# Altium project PROC154E3_SCH.PrjPcb (part 60 of 60)
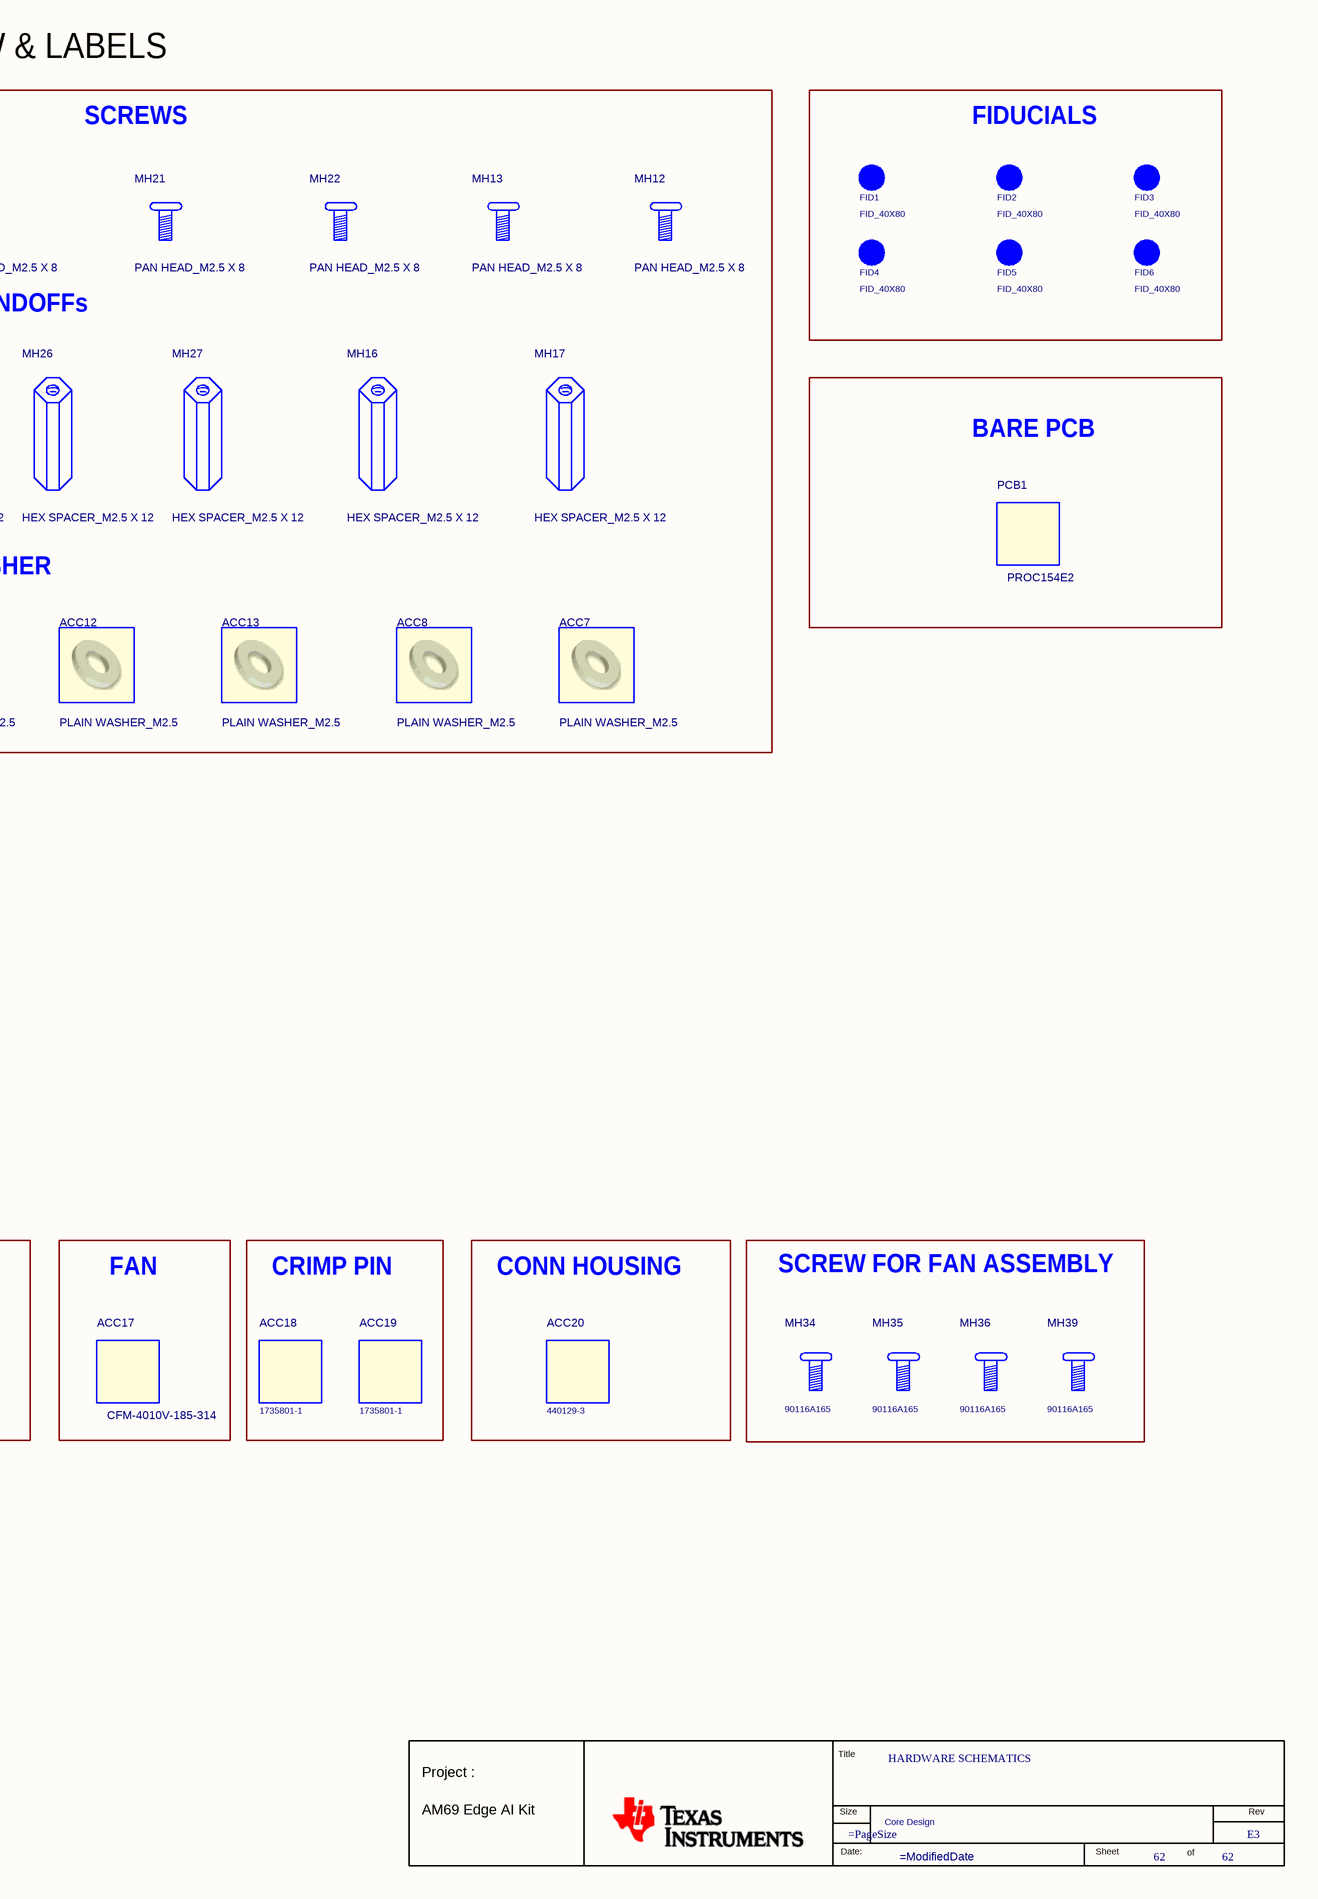
[diagram p108: 62. SK NOTES, HW & LABELS.SchDoc, right]

## Nets that join several sheets
V_3V3: 16. SOC MCU OSPI0 FLASH (C753.1 R519.1 R521.2 U47.1), 17. SOC MCU & MAIN GEN IO, OSC (12 pins), 18. SOC GENERAL (6 pins), 19. SOC MCU RGMII & MMC & ADCs (R344.1 R486.1 U42.6), 20. SOC DEBUG (7 pins), 26. RESET BUTTONs (R272.2), 27. CPLD (13 pins), 28. BOARD ID & 40 Pin EXP Hdr (11 pins), 29. eMMC (C52.2 C350.1 FL78.1 U72.5), 30. MICRO SDCARD INTERFACE (7 pins), 31. USB HUB (5 pins), 32. USB 3.0 TYPE A CONN#1 (R103.1), 34. USB TYPE C 3.0 (10 pins), 35. PCIe_M.2_INTERFACE SSD (13 pins), 36. PCIe_M.2_INTERFACE SDIO (13 pins), 37. PCIe_INTERFACE 4L (11 pins), 38. MCU GB ETHERNET (19 pins), 39. CSI MUX (9 pins), 40. CSI2 CAMERA CONNECTOR (21 pins), 41. FPC Camera (8 pins), 42. DISPLAY PORT (C698.2 R203.2 R464.1 U95.1), 43. HDMI BRIDGE (15 pins), 44. SGMII EXPANSION HDR (14 pins), 45. CAN TRANSCEIVERS (C12.1 C322.1 U4.11 U63.11), 46. QUAD PORT CONSOLE (12 pins), 48. TEST AUTOMATION HEADER (C234.1 R200.2 U39.8), 50. POWER SUPPLY #1 (16 pins), 52. POWER SUPPLY #3 (13 pins), 53. SOC CPU HCPS-A (R76.1 R335.1 R516.1), 54. SOC CORE HCPS-B (R81.1), 55. SOC PMIC (27 pins), 56. SOC LDOs & LD SWITCHES (5 pins), 57. EVM SOC CURRENT_SENSE_RES (6 pins), 58. CURRENT MONITORS (17 pins), 59. CURRENT MONITORS -INA231 (11 pins), 60. SVS MONITOR (5 pins), 61. SERDES CLOCK GENERATORS (9 pins)
VBUS_5V0_TYPEA: 32. USB 3.0 TYPE A CONN#1 (7 pins), 33. USB 3.0 TYPE A CONN#2 (C574.1 C578.1 J14.1)
VCC3V3_XDS: 20. SOC DEBUG (R199.1), 47. XDS110 DEBUGGER (42 pins)
VCC_1V1: 31. USB HUB (C180.1 FL53.1), 38. MCU GB ETHERNET (11 pins), 52. POWER SUPPLY #3 (6 pins)
VCC_12V0: 37. PCIe_INTERFACE 4L (8 pins), 44. SGMII EXPANSION HDR (C806.1 C807.1 J26.27 J26.28), 49. POWER INPUT (F2.2), 51. POWER SUPPLY #2 (6 pins)
VCC_CSI_IO: 40. CSI2 CAMERA CONNECTOR (16 pins), 41. FPC Camera (11 pins)
VCCA_3V3_CORE: 54. SOC CORE HCPS-B (24 pins), 57. EVM SOC CURRENT_SENSE_RES (R78.4 R78.6)
VCCA_3V3_CPU_AVS: 53. SOC CPU HCPS-A (35 pins), 57. EVM SOC CURRENT_SENSE_RES (R53.4 R53.6)
VCCA_3V3_DDR: 55. SOC PMIC (10 pins), 57. EVM SOC CURRENT_SENSE_RES (R522.2)
VDA_DLL_0V8: 22. SOC ANALOG POWER 1 (5 pins), 53. SOC CPU HCPS-A (U100.1), 55. SOC PMIC (C254.1 U48.9), 57. EVM SOC CURRENT_SENSE_RES (TP72.1)
VDA_MCU_1V8: 19. SOC MCU RGMII & MMC & ADCs (FL59.1 FL156.1), 22. SOC ANALOG POWER 1 (48 pins), 55. SOC PMIC (C258.1 R515.2 R529.2 U48.7), 57. EVM SOC CURRENT_SENSE_RES (TP74.1)
VDA_PHY_1V8: 22. SOC ANALOG POWER 1 (8 pins), 55. SOC PMIC (C249.1 U48.13)
VDD_CPU_HCPS_GOSNS: 09. SOC CSI & DSI IF (5 pins), 10. SOC SERDES0 IF (R374.2), 11. SOC SERDES1 IF (5 pins), 12. SOC EMIF0 & LPDDR4 (94 pins), 13. SOC EMIF1 & LPDDR4 (91 pins), 14. SOC EMIF2 & LPDDR4 (94 pins), 15. SOC EMIF3 & LPDDR4 (91 pins), 16. SOC MCU OSPI0 FLASH (14 pins), 17. SOC MCU & MAIN GEN IO, OSC (25 pins), 18. SOC GENERAL (C538.1 U83.3), 19. SOC MCU RGMII & MMC & ADCs (12 pins), 20. SOC DEBUG (10 pins), 21. SOC USB2.0 (R350.1 R375.2 R377.2), 22. SOC ANALOG POWER 1 (119 pins), 23. SOC IO & SUPPORT POWER 2 (82 pins), 24. SOC DIGITAL POWER 3 (272 pins), 25. SOC GND & KELVIN SENSING (485 pins), 26. RESET BUTTONs (29 pins), 27. CPLD (42 pins), 28. BOARD ID & 40 Pin EXP Hdr (20 pins), 29. eMMC (25 pins), 30. MICRO SDCARD INTERFACE (16 pins), 31. USB HUB (32 pins), 32. USB 3.0 TYPE A CONN#1 (22 pins), 33. USB 3.0 TYPE A CONN#2 (9 pins), 34. USB TYPE C 3.0 (34 pins), 35. PCIe_M.2_INTERFACE SSD (22 pins), 36. PCIe_M.2_INTERFACE SDIO (18 pins), 37. PCIe_INTERFACE 4L (47 pins), 38. MCU GB ETHERNET (37 pins), 39. CSI MUX (7 pins), 40. CSI2 CAMERA CONNECTOR (45 pins), 41. FPC Camera (38 pins), 42. DISPLAY PORT (29 pins), 43. HDMI BRIDGE (44 pins), 44. SGMII EXPANSION HDR (37 pins), 45. CAN TRANSCEIVERS (19 pins), 46. QUAD PORT CONSOLE (48 pins), 47. XDS110 DEBUGGER (46 pins), 48. TEST AUTOMATION HEADER (12 pins), 49. POWER INPUT (50 pins), 50. POWER SUPPLY #1 (34 pins), 51. POWER SUPPLY #2 (22 pins), 52. POWER SUPPLY #3 (34 pins), 53. SOC CPU HCPS-A (61 pins), 54. SOC CORE HCPS-B (39 pins), 55. SOC PMIC (49 pins), 56. SOC LDOs & LD SWITCHES (19 pins), 58. CURRENT MONITORS (15 pins), 59. CURRENT MONITORS -INA231 (9 pins), 60. SVS MONITOR (6 pins), 61. SERDES CLOCK GENERATORS (46 pins)
VDD_CPU_HCPS_VOSNS: 20. SOC DEBUG (C600.1 U28.N27), 24. SOC DIGITAL POWER 3 (172 pins), 25. SOC GND & KELVIN SENSING (R1.1 TP3.1), 53. SOC CPU HCPS-A (12 pins), 57. EVM SOC CURRENT_SENSE_RES (TP30.1)
VDD_DDR_1V1: 12. SOC EMIF0 & LPDDR4 (70 pins), 13. SOC EMIF1 & LPDDR4 (68 pins), 14. SOC EMIF2 & LPDDR4 (70 pins), 15. SOC EMIF3 & LPDDR4 (68 pins), 23. SOC IO & SUPPORT POWER 2 (93 pins), 55. SOC PMIC (8 pins), 57. EVM SOC CURRENT_SENSE_RES (TP56.1)
VDD_IO_1V8: 12. SOC EMIF0 & LPDDR4 (19 pins), 13. SOC EMIF1 & LPDDR4 (18 pins), 14. SOC EMIF2 & LPDDR4 (19 pins), 15. SOC EMIF3 & LPDDR4 (18 pins), 23. SOC IO & SUPPORT POWER 2 (14 pins), 55. SOC PMIC (R212.2 U48.50), 57. EVM SOC CURRENT_SENSE_RES (R256.3 TP92.1)
VDD_IO_1V8_REG: 16. SOC MCU OSPI0 FLASH (13 pins), 19. SOC MCU RGMII & MMC & ADCs (R145.1 R148.1), 26. RESET BUTTONs (R544.2), 27. CPLD (C712.1 R489.2 U43.5), 29. eMMC (C364.1 R338.2), 35. PCIe_M.2_INTERFACE SSD (10 pins), 36. PCIe_M.2_INTERFACE SDIO (R517.2 R523.2), 37. PCIe_INTERFACE 4L (6 pins), 38. MCU GB ETHERNET (R329.1), 40. CSI2 CAMERA CONNECTOR (C187.1 C334.1 U10.2 U26.2), 41. FPC Camera (5 pins), 44. SGMII EXPANSION HDR (R220.2 R268.2), 50. POWER SUPPLY #1 (TP84.1), 55. SOC PMIC (C281.1 C790.1 L25.2), 57. EVM SOC CURRENT_SENSE_RES (R256.2), 61. SERDES CLOCK GENERATORS (FL196.1 FL197.1)
VDD_MCU_2V5: 38. MCU GB ETHERNET (6 pins), 52. POWER SUPPLY #3 (7 pins)
VDD_RAM_0V85: 24. SOC DIGITAL POWER 3 (FL57.2 FL61.1 FL195.2), 55. SOC PMIC (U48.49), 57. EVM SOC CURRENT_SENSE_RES (R257.3 TP83.1)
VDD_RAM_0V85_REG: 55. SOC PMIC (C280.1 C791.1 L24.2), 57. EVM SOC CURRENT_SENSE_RES (R257.2)
VDD_SD_DV: 23. SOC IO & SUPPORT POWER 2 (6 pins), 30. MICRO SDCARD INTERFACE (5 pins), 56. SOC LDOs & LD SWITCHES (6 pins)
VDD_SD_DV_PMIC: 55. SOC PMIC (C250.1 U48.11), 56. SOC LDOs & LD SWITCHES (R152.2)
VDD_WAKE0: 22. SOC ANALOG POWER 1 (11 pins), 24. SOC DIGITAL POWER 3 (211 pins), 25. SOC GND & KELVIN SENSING (R75.1 TP23.1), 54. SOC CORE HCPS-B (8 pins), 57. EVM SOC CURRENT_SENSE_RES (TP31.1)
VDDA_USB_3V3: 22. SOC ANALOG POWER 1 (FL28.2), 56. SOC LDOs & LD SWITCHES (C363.1 U74.1), 57. EVM SOC CURRENT_SENSE_RES (TP25.1)
VDDSHV0_MCU: 23. SOC IO & SUPPORT POWER 2 (24 pins), 57. EVM SOC CURRENT_SENSE_RES (R385.2)
VINPUT: 40. CSI2 CAMERA CONNECTOR (R77.2), 49. POWER INPUT (C251.1 C752.1 C755.1 D25.3), 50. POWER SUPPLY #1 (7 pins), 51. POWER SUPPLY #2 (11 pins), 52. POWER SUPPLY #3 (C302.1 R273.1 U59.2)
VMAIN_3V3: 26. RESET BUTTONs (27 pins), 27. CPLD (12 pins), 48. TEST AUTOMATION HEADER (17 pins), 52. POWER SUPPLY #3 (6 pins)
VPP_EFUSE_1V8: 20. SOC DEBUG (R158.2 R171.1), 56. SOC LDOs & LD SWITCHES (C215.1 U34.1)
VSYS_5V0: 28. BOARD ID & 40 Pin EXP Hdr (C300.1 C802.1 J27.2 J27.4), 32. USB 3.0 TYPE A CONN#1 (C115.1 C117.2 U18.2), 34. USB TYPE C 3.0 (12 pins), 41. FPC Camera (C10.1 C11.1 U3.2 U3.3), 43. HDMI BRIDGE (C236.1 U92.11), 44. SGMII EXPANSION HDR (C298.1 C305.1 J26.49 J26.50), 45. CAN TRANSCEIVERS (C14.2 C320.2 U4.3 U63.3), 51. POWER SUPPLY #2 (10 pins), 52. POWER SUPPLY #3 (C31.1 U9.4), 56. SOC LDOs & LD SWITCHES (5 pins)
AUDIO_EXT_REFCLK0: 17. SOC MCU & MAIN GEN IO, OSC (U28.AJ34), 28. BOARD ID & 40 Pin EXP Hdr (J27.18)
BOARDID_EEPROM_WP: 28. BOARD ID & 40 Pin EXP Hdr (R261.1 R263.2 U56.7), 44. SGMII EXPANSION HDR (J26.18 U50.1)
CAM0_I2C_SCL: 40. CSI2 CAMERA CONNECTOR (J31.2), 41. FPC Camera (J2.20 R20.1 U2.6)
CAM0_I2C_SDA: 40. CSI2 CAMERA CONNECTOR (J31.4), 41. FPC Camera (J2.21 R17.1 U2.5)
CAM1_I2C_SCL: 40. CSI2 CAMERA CONNECTOR (J30.2), 41. FPC Camera (J1.20 R15.1 U2.10)
CAM1_I2C_SDA: 40. CSI2 CAMERA CONNECTOR (J30.4), 41. FPC Camera (J1.21 R19.1 U2.9)
CAN_STB: 44. SGMII EXPANSION HDR (U50.2), 45. CAN TRANSCEIVERS (5 pins)
CDCI1_OE2: 44. SGMII EXPANSION HDR (R610.2), 61. SERDES CLOCK GENERATORS (R565.1 R568.2 R577.2 U112.19)
CDCI1_OE4: 44. SGMII EXPANSION HDR (R612.2), 61. SERDES CLOCK GENERATORS (R572.1 R578.2 U112.11)
CONN_CSI2_RX0_N: 09. SOC CSI & DSI IF (U28.AR36), 40. CSI2 CAMERA CONNECTOR (J30.11)
CONN_CSI2_RX0_P: 09. SOC CSI & DSI IF (U28.AR35), 40. CSI2 CAMERA CONNECTOR (J30.9)
CONN_CSI2_RX1_N: 09. SOC CSI & DSI IF (U28.AT38), 40. CSI2 CAMERA CONNECTOR (J30.15)
CONN_CSI2_RX1_P: 09. SOC CSI & DSI IF (U28.AT37), 40. CSI2 CAMERA CONNECTOR (J30.13)
CONN_CSI2_RX2_N: 09. SOC CSI & DSI IF (U28.AP35), 40. CSI2 CAMERA CONNECTOR (J30.19)
CONN_CSI2_RX2_P: 09. SOC CSI & DSI IF (U28.AP34), 40. CSI2 CAMERA CONNECTOR (J30.17)
CONN_CSI2_RX3_N: 09. SOC CSI & DSI IF (U28.AV37), 40. CSI2 CAMERA CONNECTOR (J30.23)
CONN_CSI2_RX3_P: 09. SOC CSI & DSI IF (U28.AV36), 40. CSI2 CAMERA CONNECTOR (J30.21)
CONN_CSI2_RXCLK_N: 09. SOC CSI & DSI IF (U28.AN32), 40. CSI2 CAMERA CONNECTOR (J30.7)
CONN_CSI2_RXCLK_P: 09. SOC CSI & DSI IF (U28.AN33), 40. CSI2 CAMERA CONNECTOR (J30.5)
CORE_RAM_0V85_IN+: 58. CURRENT MONITORS (C795.2 R546.1 U109.10), 59. CURRENT MONITORS -INA231 (U110.D3)
CORE_RAM_0V85_IN-: 58. CURRENT MONITORS (C795.1 R547.1 U109.8 U109.9), 59. CURRENT MONITORS -INA231 (U110.D1 U110.D2)
CPLD_TCK/CSIB_EXP_GPIO2: 16. SOC MCU OSPI0 FLASH (R433.2), 27. CPLD (U99.4)
CPLD_TDI/CSIB_EXP_GPIO4: 16. SOC MCU OSPI0 FLASH (R427.2), 27. CPLD (U99.9)
CPLD_TDO/CSIB_EXP_GPIO3: 16. SOC MCU OSPI0 FLASH (R196.2), 27. CPLD (U99.12)
CPLD_TMS/CSIB_EXP_GPIO1: 16. SOC MCU OSPI0 FLASH (R201.2), 27. CPLD (U99.7)
CSI0_RX0_A_N: 39. CSI MUX (U6.35), 40. CSI2 CAMERA CONNECTOR (J31.11)
CSI0_RX0_A_P: 39. CSI MUX (U6.36), 40. CSI2 CAMERA CONNECTOR (J31.9)
CSI0_RX0_B_N: 39. CSI MUX (U6.26), 41. FPC Camera (J2.2)
CSI0_RX0_B_P: 39. CSI MUX (U6.27), 41. FPC Camera (J2.3)
CSI0_RX0_N: 09. SOC CSI & DSI IF (U28.AU33), 39. CSI MUX (U6.8)
CSI0_RX0_P: 09. SOC CSI & DSI IF (U28.AU32), 39. CSI MUX (U6.7)
CSI0_RX1_A_N: 39. CSI MUX (U6.33), 40. CSI2 CAMERA CONNECTOR (J31.15)
CSI0_RX1_A_P: 39. CSI MUX (U6.34), 40. CSI2 CAMERA CONNECTOR (J31.13)
CSI0_RX1_B_N: 39. CSI MUX (U6.24), 41. FPC Camera (J2.5)
CSI0_RX1_B_P: 39. CSI MUX (U6.25), 41. FPC Camera (J2.6)
CSI0_RX1_N: 09. SOC CSI & DSI IF (U28.AT32), 39. CSI MUX (U6.11)
CSI0_RX1_P: 09. SOC CSI & DSI IF (U28.AT31), 39. CSI MUX (U6.10)
CSI0_RX2_A_N: 39. CSI MUX (U6.31), 40. CSI2 CAMERA CONNECTOR (J31.19)
CSI0_RX2_A_P: 39. CSI MUX (U6.32), 40. CSI2 CAMERA CONNECTOR (J31.17)
CSI0_RX2_B_N: 39. CSI MUX (U6.22), 41. FPC Camera (J2.11)
CSI0_RX2_B_P: 39. CSI MUX (U6.23), 41. FPC Camera (J2.12)
CSI0_RX2_N: 09. SOC CSI & DSI IF (U28.AV31), 39. CSI MUX (U6.13)
CSI0_RX2_P: 09. SOC CSI & DSI IF (U28.AV30), 39. CSI MUX (U6.12)
CSI0_RX3_A_N: 39. CSI MUX (U6.18), 40. CSI2 CAMERA CONNECTOR (J31.23)
CSI0_RX3_A_P: 39. CSI MUX (U6.19), 40. CSI2 CAMERA CONNECTOR (J31.21)
CSI0_RX3_B_N: 39. CSI MUX (U6.20), 41. FPC Camera (J2.14)
CSI0_RX3_B_P: 39. CSI MUX (U6.21), 41. FPC Camera (J2.15)
CSI0_RX3_N: 09. SOC CSI & DSI IF (U28.AR30), 39. CSI MUX (U6.15)
CSI0_RX3_P: 09. SOC CSI & DSI IF (U28.AR29), 39. CSI MUX (U6.14)
CSI0_RXCLK_A_N: 39. CSI MUX (U6.37), 40. CSI2 CAMERA CONNECTOR (J31.7)
CSI0_RXCLK_A_P: 39. CSI MUX (U6.38), 40. CSI2 CAMERA CONNECTOR (J31.5)
CSI0_RXCLK_B_N: 39. CSI MUX (U6.28), 41. FPC Camera (J2.8)
CSI0_RXCLK_B_P: 39. CSI MUX (U6.29), 41. FPC Camera (J2.9)
CSI0_RXCLK_N: 09. SOC CSI & DSI IF (U28.AN30), 39. CSI MUX (U6.6)
CSI0_RXCLK_P: 09. SOC CSI & DSI IF (U28.AN29), 39. CSI MUX (U6.5)
CSI1_RX0_A_N: 39. CSI MUX (U5.37), 40. CSI2 CAMERA CONNECTOR (J31.31)
CSI1_RX0_A_P: 39. CSI MUX (U5.38), 40. CSI2 CAMERA CONNECTOR (J31.29)
CSI1_RX0_B_N: 39. CSI MUX (U5.28), 41. FPC Camera (J1.2)
CSI1_RX0_B_P: 39. CSI MUX (U5.29), 41. FPC Camera (J1.3)
CSI1_RX0_N: 09. SOC CSI & DSI IF (U28.AT35), 39. CSI MUX (U5.6)
CSI1_RX0_P: 09. SOC CSI & DSI IF (U28.AT34), 39. CSI MUX (U5.5)
CSI1_RX1_A_N: 39. CSI MUX (U5.35), 40. CSI2 CAMERA CONNECTOR (J31.35)
CSI1_RX1_A_P: 39. CSI MUX (U5.36), 40. CSI2 CAMERA CONNECTOR (J31.33)
CSI1_RX1_B_N: 39. CSI MUX (U5.26), 41. FPC Camera (J1.5)
CSI1_RX1_B_P: 39. CSI MUX (U5.27), 41. FPC Camera (J1.6)
CSI1_RX1_N: 09. SOC CSI & DSI IF (U28.AU36), 39. CSI MUX (U5.8)
CSI1_RX1_P: 09. SOC CSI & DSI IF (U28.AU35), 39. CSI MUX (U5.7)
CSI1_RX2_A_N: 39. CSI MUX (U5.33), 40. CSI2 CAMERA CONNECTOR (J31.39)
CSI1_RX2_A_P: 39. CSI MUX (U5.34), 40. CSI2 CAMERA CONNECTOR (J31.37)
CSI1_RX2_B_N: 39. CSI MUX (U5.24), 41. FPC Camera (J1.11)
CSI1_RX2_B_P: 39. CSI MUX (U5.25), 41. FPC Camera (J1.12)
CSI1_RX2_N: 09. SOC CSI & DSI IF (U28.AR33), 39. CSI MUX (U5.11)
CSI1_RX2_P: 09. SOC CSI & DSI IF (U28.AR32), 39. CSI MUX (U5.10)
CSI1_RX3_A_N: 39. CSI MUX (U5.18), 40. CSI2 CAMERA CONNECTOR (J31.28)
CSI1_RX3_A_P: 39. CSI MUX (U5.19), 40. CSI2 CAMERA CONNECTOR (J31.26)
CSI1_RX3_B_N: 39. CSI MUX (U5.20), 41. FPC Camera (J1.14)
CSI1_RX3_B_P: 39. CSI MUX (U5.21), 41. FPC Camera (J1.15)
CSI1_RX3_N: 09. SOC CSI & DSI IF (U28.AV34), 39. CSI MUX (U5.15)
CSI1_RX3_P: 09. SOC CSI & DSI IF (U28.AV33), 39. CSI MUX (U5.14)
CSI1_RXCLK_A_N: 39. CSI MUX (U5.42), 40. CSI2 CAMERA CONNECTOR (J31.27)
CSI1_RXCLK_A_P: 39. CSI MUX (U5.41), 40. CSI2 CAMERA CONNECTOR (J31.25)
CSI1_RXCLK_B_N: 39. CSI MUX (U5.40), 41. FPC Camera (J1.8)
CSI1_RXCLK_B_P: 39. CSI MUX (U5.39), 41. FPC Camera (J1.9)
CSI1_RXCLK_N: 09. SOC CSI & DSI IF (U28.AP32), 39. CSI MUX (U5.3)
CSI1_RXCLK_P: 09. SOC CSI & DSI IF (U28.AP31), 39. CSI MUX (U5.4)
CSI_EXP_GPIO_1: 16. SOC MCU OSPI0 FLASH (U28.C31), 40. CSI2 CAMERA CONNECTOR (U26.1)
CSI_EXP_GPIO_2: 16. SOC MCU OSPI0 FLASH (U28.G31), 40. CSI2 CAMERA CONNECTOR (U26.3)
CSI_EXP_GPIO_3: 16. SOC MCU OSPI0 FLASH (U28.F33), 40. CSI2 CAMERA CONNECTOR (U26.4)
CSI_EXP_GPIO_4: 16. SOC MCU OSPI0 FLASH (U28.G32), 40. CSI2 CAMERA CONNECTOR (U26.5)
CSI_EXP_GPIO_5: 16. SOC MCU OSPI0 FLASH (U28.D31), 40. CSI2 CAMERA CONNECTOR (U26.6)
CSI_MUX_SEL_2: 39. CSI MUX (R18.1 R22.2 U5.17 U6.17), 40. CSI2 CAMERA CONNECTOR (U1.3)
CSI_VIO_SEL: 40. CSI2 CAMERA CONNECTOR (U1.2), 41. FPC Camera (R12.1 U3.1)
CSIB_EXP_GPIO1: 27. CPLD (U99.5), 40. CSI2 CAMERA CONNECTOR (U10.1)
CSIB_EXP_GPIO2: 27. CPLD (U99.2), 40. CSI2 CAMERA CONNECTOR (U10.3)
CSIB_EXP_GPIO3: 27. CPLD (U99.14), 40. CSI2 CAMERA CONNECTOR (U10.4)
CSIB_EXP_GPIO4: 27. CPLD (U99.11), 40. CSI2 CAMERA CONNECTOR (U10.5)
CSIB_EXP_GPIO5: 16. SOC MCU OSPI0 FLASH (U28.G33), 40. CSI2 CAMERA CONNECTOR (U10.6)
DP0_3V3 _EN: 18. SOC GENERAL (U28.AH33), 42. DISPLAY PORT (R496.1 U95.3)
DP0_AUX_N: 10. SOC SERDES0 IF (C231.2), 42. DISPLAY PORT (L19.4)
DP0_AUX_P: 10. SOC SERDES0 IF (C232.2), 42. DISPLAY PORT (L19.1)
DP0_HPD: 18. SOC GENERAL (U83.2), 42. DISPLAY PORT (J16.A18 R449.2)
DP0_TX0_N: 11. SOC SERDES1 IF (C219.2), 42. DISPLAY PORT (L13.4)
DP0_TX0_P: 11. SOC SERDES1 IF (C221.2), 42. DISPLAY PORT (L13.1)
DP0_TX1_N: 11. SOC SERDES1 IF (C202.2), 42. DISPLAY PORT (L11.1)
DP0_TX1_P: 11. SOC SERDES1 IF (C201.2), 42. DISPLAY PORT (L11.4)
DP0_TX2_N: 11. SOC SERDES1 IF (C224.2), 42. DISPLAY PORT (L14.4)
DP0_TX2_P: 11. SOC SERDES1 IF (C225.2), 42. DISPLAY PORT (L14.1)
DP0_TX3_N: 11. SOC SERDES1 IF (C211.2), 42. DISPLAY PORT (L12.1)
DP0_TX3_P: 11. SOC SERDES1 IF (C208.2), 42. DISPLAY PORT (L12.4)
EHRPWM0_A: 18. SOC GENERAL (U28.AM37), 28. BOARD ID & 40 Pin EXP Hdr (J27.33)
EHRPWM3_A: 18. SOC GENERAL (U28.AE35), 28. BOARD ID & 40 Pin EXP Hdr (J27.32)
EN_3V3_VIO: 26. RESET BUTTONs (R559.2), 55. SOC PMIC (U48.19), 56. SOC LDOs & LD SWITCHES (5 pins)
EN_EFUSE_VPP: 16. SOC MCU OSPI0 FLASH (U28.A33), 56. SOC LDOs & LD SWITCHES (R172.1 U34.4)
ENET1_EXP_INTB: 19. SOC MCU RGMII & MMC & ADCs (U28.W33), 44. SGMII EXPANSION HDR (J26.31 R268.1)
EXT_CTI_EMU0: 17. SOC MCU & MAIN GEN IO, OSC (J15.13), 20. SOC DEBUG (U89.11)
EXT_CTI_EMU1: 17. SOC MCU & MAIN GEN IO, OSC (J15.14), 20. SOC DEBUG (U89.14)
EXT_CTI_TCK: 17. SOC MCU & MAIN GEN IO, OSC (J15.11 R151.1 R153.2), 20. SOC DEBUG (U89.2)
EXT_CTI_TDI: 17. SOC MCU & MAIN GEN IO, OSC (J15.3), 20. SOC DEBUG (U37.5)
EXT_CTI_TDO: 17. SOC MCU & MAIN GEN IO, OSC (J15.7), 20. SOC DEBUG (U37.2)
EXT_CTI_TMS: 17. SOC MCU & MAIN GEN IO, OSC (J15.1), 20. SOC DEBUG (U37.11)
EXT_CTI_TRST#: 17. SOC MCU & MAIN GEN IO, OSC (J15.2 R143.1), 20. SOC DEBUG (U89.5)
GPIO0_3: 18. SOC GENERAL (U28.AF33), 28. BOARD ID & 40 Pin EXP Hdr (J27.16)
GPIO0_27: 18. SOC GENERAL (U28.AJ37), 28. BOARD ID & 40 Pin EXP Hdr (J27.37)
GPIO0_36: 18. SOC GENERAL (U28.AC35), 28. BOARD ID & 40 Pin EXP Hdr (J27.13)
GPIO0_41/UART5_CTSn: 18. SOC GENERAL (U28.AJ36), 28. BOARD ID & 40 Pin EXP Hdr (J27.36)
GPIO0_42/UART5_RTSn: 18. SOC GENERAL (U28.AF34), 28. BOARD ID & 40 Pin EXP Hdr (J27.11)
GPIO_uSD_PWR_EN: 30. MICRO SDCARD INTERFACE (R173.2 U35.2), 44. SGMII EXPANSION HDR (U50.3)
H_WKUP_I2C0_SCL: 53. SOC CPU HCPS-A (U13.13), 54. SOC CORE HCPS-B (U16.13), 55. SOC PMIC (U48.31), 60. SVS MONITOR (U101.4)
H_WKUP_I2C0_SDA: 53. SOC CPU HCPS-A (U13.12), 54. SOC CORE HCPS-B (U16.12), 55. SOC PMIC (U48.30), 60. SVS MONITOR (U101.7)
HDMI_HPD: 18. SOC GENERAL (U28.AN35), 43. HDMI BRIDGE (U92.4)
HDMI_LS_OE: 17. SOC MCU & MAIN GEN IO, OSC (R292.1 U28.L33), 43. HDMI BRIDGE (R474.2 U92.5)
HDMI_PDn: 17. SOC MCU & MAIN GEN IO, OSC (R416.2 U28.H37), 43. HDMI BRIDGE (R165.2 U29.10)
I2C0_SCL: 18. SOC GENERAL (R137.2 U28.AN36), 35. PCIe_M.2_INTERFACE SSD (U49.12), 37. PCIe_INTERFACE 4L (U65.12), 44. SGMII EXPANSION HDR (J26.24 U50.19), 48. TEST AUTOMATION HEADER (U39.7), 49. POWER INPUT (R233.1), 55. SOC PMIC (R507.2), 61. SERDES CLOCK GENERATORS (R566.1 R613.1)
I2C0_SDA: 18. SOC GENERAL (R135.2 U28.AP37), 35. PCIe_M.2_INTERFACE SSD (U49.13), 37. PCIe_INTERFACE 4L (U65.13), 44. SGMII EXPANSION HDR (J26.25 U50.20), 48. TEST AUTOMATION HEADER (U39.6), 49. POWER INPUT (R232.1), 55. SOC PMIC (R506.2), 61. SERDES CLOCK GENERATORS (R568.1 R614.2)
I2C1_SCL: 18. SOC GENERAL (R136.1 U28.AE34), 40. CSI2 CAMERA CONNECTOR (U1.12), 41. FPC Camera (U2.12)
I2C1_SDA: 18. SOC GENERAL (R134.1 U28.AL33), 40. CSI2 CAMERA CONNECTOR (U1.13), 41. FPC Camera (U2.13)
IO_EXP_CAM0_GPIO1: 40. CSI2 CAMERA CONNECTOR (U1.5), 41. FPC Camera (R289.1 U62.13)
IO_EXP_CAM1_GPIO1: 40. CSI2 CAMERA CONNECTOR (U1.7), 41. FPC Camera (R288.1 U62.11)
IO_EXP_I2C0_INTB: 19. SOC MCU RGMII & MMC & ADCs (U28.U33), 44. SGMII EXPANSION HDR (R220.1 U50.22)
IO_EXP_MCU_RGMII_RST#: 27. CPLD (U94.38), 44. SGMII EXPANSION HDR (U50.4)
IO_EXP_PCIe0_4L_PERST#: 27. CPLD (TP50.1 U94.10), 44. SGMII EXPANSION HDR (U50.5)
IO_EXP_PCIe1_M.2_RTSz: 27. CPLD (U94.34), 44. SGMII EXPANSION HDR (U50.6)
IO_EXP_PCIe3_M.2_RTSz: 27. CPLD (R456.2), 44. SGMII EXPANSION HDR (U50.7)
JTAG_MUX_SEL: 17. SOC MCU & MAIN GEN IO, OSC (J15.8), 20. SOC DEBUG (R198.1 R199.2 U37.1 U89.1)
JTAG_RESETz: 17. SOC MCU & MAIN GEN IO, OSC (J15.15), 27. CPLD (U94.33)
LM5143_ON: 26. RESET BUTTONs (U60.4), 50. POWER SUPPLY #1 (U11.31 U11.40), 51. POWER SUPPLY #2 (R253.2 R554.2)
LM5143_PG: 26. RESET BUTTONs (R534.1), 27. CPLD (U91.15), 50. POWER SUPPLY #1 (R316.1 U11.7 U11.24)
MCAN6_RX: 18. SOC GENERAL (U28.AH36), 45. CAN TRANSCEIVERS (R281.1)
MCAN6_TX: 18. SOC GENERAL (U28.AG35), 45. CAN TRANSCEIVERS (U63.1)
MCAN7_RX: 18. SOC GENERAL (U28.AD34), 45. CAN TRANSCEIVERS (R287.1)
MCAN7_TX: 18. SOC GENERAL (U28.AF35), 45. CAN TRANSCEIVERS (U63.6)
MCASP1_ACLKX: 18. SOC GENERAL (U28.AC34), 28. BOARD ID & 40 Pin EXP Hdr (J27.12)
MCASP1_AFSX: 18. SOC GENERAL (U28.AD33), 28. BOARD ID & 40 Pin EXP Hdr (J27.35)
MCASP1_AXR0: 18. SOC GENERAL (U28.AD38), 28. BOARD ID & 40 Pin EXP Hdr (J27.38)
MCASP1_AXR4: 18. SOC GENERAL (U28.AL34), 28. BOARD ID & 40 Pin EXP Hdr (J27.40)
MCU_ADC_EXT_TRIGGER0: 17. SOC MCU & MAIN GEN IO, OSC (R292.2), 19. SOC MCU RGMII & MMC & ADCs (J7.7)
MCU_BOOTMODE03: 17. SOC MCU & MAIN GEN IO, OSC (R446.1), 27. CPLD (R442.1)
MCU_BOOTMODE04: 17. SOC MCU & MAIN GEN IO, OSC (R419.1), 27. CPLD (R438.1)
MCU_BOOTMODE05: 17. SOC MCU & MAIN GEN IO, OSC (R411.1), 27. CPLD (R437.1)
MCU_CLKOUT0: 17. SOC MCU & MAIN GEN IO, OSC (U28.M38), 40. CSI2 CAMERA CONNECTOR (U64.4 U64.5)
MCU_I2C0_SCL: 17. SOC MCU & MAIN GEN IO, OSC (R227.2 U28.M35), 28. BOARD ID & 40 Pin EXP Hdr (J27.5)
MCU_I2C0_SDA: 17. SOC MCU & MAIN GEN IO, OSC (R229.2 U28.G34), 28. BOARD ID & 40 Pin EXP Hdr (J27.3)
MCU_I2C1_SCL: 17. SOC MCU & MAIN GEN IO, OSC (R475.1 U28.L35), 43. HDMI BRIDGE (U92.2)
MCU_I2C1_SDA: 17. SOC MCU & MAIN GEN IO, OSC (R476.1 U28.L34), 43. HDMI BRIDGE (U92.3)
MCU_MCAN0_RX: 17. SOC MCU & MAIN GEN IO, OSC (U28.F38), 45. CAN TRANSCEIVERS (R16.1)
MCU_MCAN0_TX: 17. SOC MCU & MAIN GEN IO, OSC (U28.K33), 45. CAN TRANSCEIVERS (U4.1)
MCU_MCAN1_RX: 17. SOC MCU & MAIN GEN IO, OSC (U28.K36), 45. CAN TRANSCEIVERS (R7.1)
MCU_MCAN1_TX: 17. SOC MCU & MAIN GEN IO, OSC (U28.H35), 45. CAN TRANSCEIVERS (U4.6)
MCU_MDIO0_MDIO: 19. SOC MCU RGMII & MMC & ADCs (R344.2 U28.B35), 38. MCU GB ETHERNET (U77.17), 44. SGMII EXPANSION HDR (J26.43)
MCU_PORZ: 17. SOC MCU & MAIN GEN IO, OSC (R401.2 U28.K32), 27. CPLD (R493.2 U43.2), 55. SOC PMIC (R513.2 R540.2)
MCU_PORz_3V3: 27. CPLD (R492.2 TP53.1 U43.4 U94.43), 61. SERDES CLOCK GENERATORS (U112.8)
MCU_RESETSTATZ: 16. SOC MCU OSPI0 FLASH (R219.2 U96.2), 17. SOC MCU & MAIN GEN IO, OSC (R423.1 TP51.1 U28.F36), 19. SOC MCU RGMII & MMC & ADCs (J7.6), 46. QUAD PORT CONSOLE (U73.2)
MCU_RESETZ: 17. SOC MCU & MAIN GEN IO, OSC (R175.2 U28.G36), 19. SOC MCU RGMII & MMC & ADCs (J7.8), 27. CPLD (R494.2)
MCU_RGMII_INT#: 19. SOC MCU RGMII & MMC & ADCs (U28.V34), 38. MCU GB ETHERNET (R329.2 U77.44)
MCU_RGMII_RD0: 19. SOC MCU RGMII & MMC & ADCs (U28.A35), 38. MCU GB ETHERNET (R313.1 R314.2 U77.33)
MCU_RGMII_RD1: 19. SOC MCU RGMII & MMC & ADCs (U28.B36), 38. MCU GB ETHERNET (U77.34)
MCU_RGMII_RD2: 19. SOC MCU RGMII & MMC & ADCs (U28.C36), 38. MCU GB ETHERNET (R54.1 R315.2 U77.35)
MCU_RGMII_RD3: 19. SOC MCU RGMII & MMC & ADCs (U28.D36), 38. MCU GB ETHERNET (U77.36)
MCU_RGMII_RST#: 27. CPLD (U94.26), 38. MCU GB ETHERNET (U77.43)
MCU_RGMII_RX_CTL: 19. SOC MCU RGMII & MMC & ADCs (U28.C37), 38. MCU GB ETHERNET (R56.1 R325.2 U77.38)
MCU_RGMII_RXC: 19. SOC MCU RGMII & MMC & ADCs (U28.B37), 38. MCU GB ETHERNET (R312.1)
MCU_RGMII_TD0: 19. SOC MCU RGMII & MMC & ADCs (U28.D37), 38. MCU GB ETHERNET (U77.28)
MCU_RGMII_TD1: 19. SOC MCU RGMII & MMC & ADCs (U28.D38), 38. MCU GB ETHERNET (U77.27)
MCU_RGMII_TD2: 19. SOC MCU RGMII & MMC & ADCs (U28.E37), 38. MCU GB ETHERNET (U77.26)
MCU_RGMII_TD3: 19. SOC MCU RGMII & MMC & ADCs (U28.E38), 38. MCU GB ETHERNET (U77.25)
MCU_RGMII_TX_CTL: 19. SOC MCU RGMII & MMC & ADCs (U28.C38), 38. MCU GB ETHERNET (U77.37)
MCU_RGMII_TXC: 19. SOC MCU RGMII & MMC & ADCs (U28.E36), 38. MCU GB ETHERNET (U77.29)
MCU_SAFETY_ERRZ: 17. SOC MCU & MAIN GEN IO, OSC (TP71.1 U28.N36), 19. SOC MCU RGMII & MMC & ADCs (J7.2), 55. SOC PMIC (R505.1)
MCU_SPI1_CLK: 17. SOC MCU & MAIN GEN IO, OSC (R446.2 U28.H38), 28. BOARD ID & 40 Pin EXP Hdr (U53.8)
MCU_SPI1_CS0: 17. SOC MCU & MAIN GEN IO, OSC (U28.J36), 28. BOARD ID & 40 Pin EXP Hdr (J27.24)
MCU_SPI1_CS2: 17. SOC MCU & MAIN GEN IO, OSC (R407.2 U28.K37), 28. BOARD ID & 40 Pin EXP Hdr (U53.9)
MCU_SPI1_D0: 17. SOC MCU & MAIN GEN IO, OSC (R419.2 U28.J34), 28. BOARD ID & 40 Pin EXP Hdr (U53.6)
MCU_SPI1_D1: 17. SOC MCU & MAIN GEN IO, OSC (R411.2 U28.J35), 28. BOARD ID & 40 Pin EXP Hdr (U53.7)
MCU_UART0_RXD: 17. SOC MCU & MAIN GEN IO, OSC (R170.2 U28.K38), 46. QUAD PORT CONSOLE (U70.6)
MCU_UART0_TXD: 17. SOC MCU & MAIN GEN IO, OSC (R413.2 U28.J37), 46. QUAD PORT CONSOLE (R299.2 U70.8)
MDIO0_MDC_RGMII: 19. SOC MCU RGMII & MMC & ADCs (R211.1 U42.3), 38. MCU GB ETHERNET (U77.16)
MDIO0_MDC_SGMII: 19. SOC MCU RGMII & MMC & ADCs (U42.5), 44. SGMII EXPANSION HDR (J26.42 R270.2)
MMC0_CLK: 19. SOC MCU RGMII & MMC & ADCs (U28.AK5), 29. eMMC (U12.M6)
MMC0_CMD: 19. SOC MCU RGMII & MMC & ADCs (U28.AL8), 29. eMMC (R337.2 U12.M5)
MMC0_DAT0: 19. SOC MCU RGMII & MMC & ADCs (U28.AK9), 29. eMMC (R336.2 U12.A3)
MMC0_DAT1: 19. SOC MCU RGMII & MMC & ADCs (U28.AL6), 29. eMMC (R331.2 U12.A4)
MMC0_DAT2: 19. SOC MCU RGMII & MMC & ADCs (U28.AK8), 29. eMMC (R330.2 U12.A5)
MMC0_DAT3: 19. SOC MCU RGMII & MMC & ADCs (U28.AK6), 29. eMMC (R342.2 U12.B2)
MMC0_DAT4: 19. SOC MCU RGMII & MMC & ADCs (U28.AK7), 29. eMMC (R341.2 U12.B3)
MMC0_DAT5: 19. SOC MCU RGMII & MMC & ADCs (U28.AL7), 29. eMMC (R333.2 U12.B4)
MMC0_DAT6: 19. SOC MCU RGMII & MMC & ADCs (U28.AL5), 29. eMMC (R317.2 U12.B5)
MMC0_DAT7: 19. SOC MCU RGMII & MMC & ADCs (U28.AK3), 29. eMMC (R311.2 U12.B6)
MMC0_DS: 19. SOC MCU RGMII & MMC & ADCs (U28.AK4), 29. eMMC (R318.1 R319.2)
MMC1_CLK: 19. SOC MCU RGMII & MMC & ADCs (R147.2), 30. MICRO SDCARD INTERFACE (J32.5 U30.5)
MMC1_CMD: 19. SOC MCU RGMII & MMC & ADCs (U28.AB36), 30. MICRO SDCARD INTERFACE (J32.3 R395.2 U30.3)
MMC1_DAT0: 19. SOC MCU RGMII & MMC & ADCs (U28.AA33), 30. MICRO SDCARD INTERFACE (J32.7 R389.2 U27.3)
MMC1_DAT1: 19. SOC MCU RGMII & MMC & ADCs (U28.AB34), 30. MICRO SDCARD INTERFACE (J32.8 R386.2 U27.5)
MMC1_DAT2: 19. SOC MCU RGMII & MMC & ADCs (U28.AA32), 30. MICRO SDCARD INTERFACE (J32.1 R398.2 U31.3)
MMC1_DAT3: 19. SOC MCU RGMII & MMC & ADCs (U28.AC38), 30. MICRO SDCARD INTERFACE (J32.2 R397.2 U31.5)
OVERCUR1z: 31. USB HUB (U20.46), 32. USB 3.0 TYPE A CONN#1 (R103.2 U18.10), 34. USB TYPE C 3.0 (U38.8)
PB_PORz: 26. RESET BUTTONs (U58.5 U106.6), 27. CPLD (U91.12)
PCIe0_4L_PERST#: 27. CPLD (R495.2), 37. PCIe_INTERFACE 4L (J3.A11 R280.1)
PCIE0_CARD_REFCLK_N: 37. PCIe_INTERFACE 4L (J3.A14 R23.1), 61. SERDES CLOCK GENERATORS (R574.2 R585.1)
PCIE0_CARD_REFCLK_P: 37. PCIe_INTERFACE 4L (J3.A13 R23.2), 61. SERDES CLOCK GENERATORS (R573.2 R584.1)
PCIe0_CLKREQ#: 37. PCIe_INTERFACE 4L (J3.B12 R30.2), 44. SGMII EXPANSION HDR (U50.13)
PCIE0_PRSNT2#_1: 37. PCIe_INTERFACE 4L (J3.B17 R27.2), 44. SGMII EXPANSION HDR (R609.2)
PCIe0_PRSNT2#_2: 37. PCIe_INTERFACE 4L (R27.1 R28.1 R29.2), 44. SGMII EXPANSION HDR (R611.2)
PCIe0_RX0_N: 11. SOC SERDES1 IF (U28.AU5), 37. PCIe_INTERFACE 4L (J3.A17)
PCIe0_RX0_P: 11. SOC SERDES1 IF (U28.AU6), 37. PCIe_INTERFACE 4L (J3.A16)
PCIe0_RX1_N: 11. SOC SERDES1 IF (U28.AT4), 37. PCIe_INTERFACE 4L (J3.A22)
PCIe0_RX1_P: 11. SOC SERDES1 IF (U28.AT5), 37. PCIe_INTERFACE 4L (J3.A21)
PCIe0_RX2_N: 11. SOC SERDES1 IF (U28.AU2), 37. PCIe_INTERFACE 4L (J3.A26)
PCIe0_RX2_P: 11. SOC SERDES1 IF (U28.AU3), 37. PCIe_INTERFACE 4L (J3.A25)
PCIe0_RX3_N: 11. SOC SERDES1 IF (U28.AT1), 37. PCIe_INTERFACE 4L (J3.A30)
PCIe0_RX3_P: 11. SOC SERDES1 IF (U28.AT2), 37. PCIe_INTERFACE 4L (J3.A29)
PCIe0_TX0_N: 11. SOC SERDES1 IF (C16.2), 37. PCIe_INTERFACE 4L (J3.B15)
PCIe0_TX0_P: 11. SOC SERDES1 IF (C15.2), 37. PCIe_INTERFACE 4L (J3.B14)
PCIe0_TX1_N: 11. SOC SERDES1 IF (C21.2), 37. PCIe_INTERFACE 4L (J3.B20)
PCIe0_TX1_P: 11. SOC SERDES1 IF (C22.2), 37. PCIe_INTERFACE 4L (J3.B19)
PCIe0_TX2_N: 11. SOC SERDES1 IF (C18.2), 37. PCIe_INTERFACE 4L (J3.B24)
PCIe0_TX2_P: 11. SOC SERDES1 IF (C17.2), 37. PCIe_INTERFACE 4L (J3.B23)
PCIe0_TX3_N: 11. SOC SERDES1 IF (C19.2), 37. PCIe_INTERFACE 4L (J3.B28)
PCIe0_TX3_P: 11. SOC SERDES1 IF (C20.2), 37. PCIe_INTERFACE 4L (J3.B27)
PCIe1_M.2_CLKREQ#: 35. PCIe_M.2_INTERFACE SSD (J12.52 R305.1 TP21.1), 44. SGMII EXPANSION HDR (U50.14)
PCIe1_M.2_RTSz: 27. CPLD (U94.23), 35. PCIe_M.2_INTERFACE SSD (J12.50 R306.2 R307.2)
PCIE1_RX0_N: 10. SOC SERDES0 IF (U28.AR8), 35. PCIe_M.2_INTERFACE SSD (J12.41)
PCIE1_RX0_P: 10. SOC SERDES0 IF (U28.AR9), 35. PCIe_M.2_INTERFACE SSD (J12.43)
PCIE1_RX1_N: 10. SOC SERDES0 IF (U28.AT10), 35. PCIe_M.2_INTERFACE SSD (J12.29)
PCIE1_RX1_P: 10. SOC SERDES0 IF (U28.AT11), 35. PCIe_M.2_INTERFACE SSD (J12.31)
PCIE1_TX0_N: 10. SOC SERDES0 IF (C26.2), 35. PCIe_M.2_INTERFACE SSD (J12.47)
PCIE1_TX0_P: 10. SOC SERDES0 IF (C27.2), 35. PCIe_M.2_INTERFACE SSD (J12.49)
PCIE1_TX1_N: 10. SOC SERDES0 IF (C28.2), 35. PCIe_M.2_INTERFACE SSD (J12.35)
PCIE1_TX1_P: 10. SOC SERDES0 IF (C29.2), 35. PCIe_M.2_INTERFACE SSD (J12.37)
PCIe3_M.2_ALERT#: 35. PCIe_M.2_INTERFACE SSD (R238.1 U49.8), 36. PCIe_M.2_INTERFACE SDIO (J23.62)
PCIe3_M.2_CLKREQ#: 36. PCIe_M.2_INTERFACE SDIO (J23.53 R543.1), 44. SGMII EXPANSION HDR (U50.15)
PCIe3_M.2_RTSz: 27. CPLD (U94.24), 36. PCIe_M.2_INTERFACE SDIO (J23.52 R236.2 R242.2)
PCIe3_M.2_SCL: 35. PCIe_M.2_INTERFACE SSD (R240.2 U49.10), 36. PCIe_M.2_INTERFACE SDIO (J23.60)
PCIe3_M.2_SDA: 35. PCIe_M.2_INTERFACE SSD (R239.2 U49.9), 36. PCIe_M.2_INTERFACE SDIO (J23.58)
PCIe3_M.2_SUSCLK: 36. PCIe_M.2_INTERFACE SDIO (J23.50), 55. SOC PMIC (R250.2)
PCIe3_TX0_N: 10. SOC SERDES0 IF (C162.2), 36. PCIe_M.2_INTERFACE SDIO (J23.37)
PCIe3_TX0_P: 10. SOC SERDES0 IF (C161.2), 36. PCIe_M.2_INTERFACE SDIO (J23.35)
PCIE_REFCLK1_N_CONN: 35. PCIe_M.2_INTERFACE SSD (J12.53 R40.2), 61. SERDES CLOCK GENERATORS (R606.1 R689.2)
PCIE_REFCLK1_P_CONN: 35. PCIe_M.2_INTERFACE SSD (J12.55 R40.1), 61. SERDES CLOCK GENERATORS (R605.1 R690.2)
PM2_SCL: 47. XDS110 DEBUGGER (R481.2), 48. TEST AUTOMATION HEADER (J17.36 R428.2 U39.2), 58. CURRENT MONITORS (9 pins), 59. CURRENT MONITORS -INA231 (9 pins), 60. SVS MONITOR (J19.1)
PM2_SDA: 47. XDS110 DEBUGGER (R490.2), 48. TEST AUTOMATION HEADER (J17.38 R429.2 U39.3), 58. CURRENT MONITORS (7 pins), 59. CURRENT MONITORS -INA231 (7 pins), 60. SVS MONITOR (J19.2)
PM_INA_BUS_EN: 44. SGMII EXPANSION HDR (U50.8), 48. TEST AUTOMATION HEADER (R200.1 U39.5)
PMIC_INTn: 19. SOC MCU RGMII & MMC & ADCs (U28.AA37), 55. SOC PMIC (R212.1 TP62.1 U48.14)
PWRCTL1/BATEN1: 31. USB HUB (U20.36), 32. USB 3.0 TYPE A CONN#1 (R96.2), 34. USB TYPE C 3.0 (U93.2)
QSGMII1_PHY_REFCLK_N: 11. SOC SERDES1 IF (R110.1 R121.1), 44. SGMII EXPANSION HDR (J26.39)
QSGMII1_PHY_REFCLK_P: 11. SOC SERDES1 IF (R109.1 R120.1), 44. SGMII EXPANSION HDR (J26.40)
R_PCIE3_M2_REFCLK_N: 36. PCIe_M.2_INTERFACE SDIO (J23.49 R538.1), 61. SERDES CLOCK GENERATORS (R608.1 R692.2)
R_PCIE3_M2_REFCLK_P: 36. PCIe_M.2_INTERFACE SDIO (J23.47 R538.2), 61. SERDES CLOCK GENERATORS (R607.1 R691.2)
RESETSTATZ: 17. SOC MCU & MAIN GEN IO, OSC (R309.1 TP101.1 U28.AL38), 27. CPLD (R465.2), 29. eMMC (R308.1), 30. MICRO SDCARD INTERFACE (R188.1), 31. USB HUB (U20.50), 35. PCIe_M.2_INTERFACE SSD (U49.3), 37. PCIe_INTERFACE 4L (U65.3), 40. CSI2 CAMERA CONNECTOR (R2.1), 41. FPC Camera (U2.3), 44. SGMII EXPANSION HDR (R222.1)
RPi_GPIO_BUF_EN: 27. CPLD (U94.41), 28. BOARD ID & 40 Pin EXP Hdr (R264.2 U53.19)
SEL_SDIO_3V3_1V8n: 18. SOC GENERAL (U28.AD36), 55. SOC PMIC (R502.2), 56. SOC LDOs & LD SWITCHES (R396.1 U87.6)
SERDES0_RX2_N: 10. SOC SERDES0 IF (U28.AR11), 36. PCIe_M.2_INTERFACE SDIO (J23.43)
SERDES0_RX2_P: 10. SOC SERDES0 IF (U28.AR12), 36. PCIe_M.2_INTERFACE SDIO (J23.41)
SERDES0_RX3_N: 10. SOC SERDES0 IF (U28.AU11), 31. USB HUB (C177.1)
SERDES0_RX3_P: 10. SOC SERDES0 IF (U28.AU12), 31. USB HUB (C176.1)
SGMII1_RX0_N: 11. SOC SERDES1 IF (U28.AU20), 44. SGMII EXPANSION HDR (J26.6)
SGMII1_RX0_P: 11. SOC SERDES1 IF (U28.AU21), 44. SGMII EXPANSION HDR (J26.5)
SGMII1_TX0_N: 11. SOC SERDES1 IF (C309.2), 44. SGMII EXPANSION HDR (J26.3)
SGMII1_TX0_P: 11. SOC SERDES1 IF (C310.2), 44. SGMII EXPANSION HDR (J26.2)
SGMII2_RX0_N: 11. SOC SERDES1 IF (U28.AT19), 44. SGMII EXPANSION HDR (J26.37)
SGMII2_RX0_P: 11. SOC SERDES1 IF (U28.AT20), 44. SGMII EXPANSION HDR (J26.36)
SGMII2_TX0_N: 11. SOC SERDES1 IF (C308.2), 44. SGMII EXPANSION HDR (J26.34)
SGMII2_TX0_P: 11. SOC SERDES1 IF (C307.2), 44. SGMII EXPANSION HDR (J26.33)
SOC_PWRGRP_IRQn: 53. SOC CPU HCPS-A (5 pins), 54. SOC CORE HCPS-B (U16.4 U19.4), 55. SOC PMIC (TP79.1 U48.42)
SOC_SAFETY_ERRZ: 17. SOC MCU & MAIN GEN IO, OSC (U28.AM34), 19. SOC MCU RGMII & MMC & ADCs (J7.4), 55. SOC PMIC (R528.1)
SOC_SERDES0_REFCLK_N: 10. SOC SERDES0 IF (R115.1), 61. SERDES CLOCK GENERATORS (R567.2 R581.1)
SOC_SERDES0_REFCLK_P: 10. SOC SERDES0 IF (R116.1), 61. SERDES CLOCK GENERATORS (R569.2 R580.1)
SOC_SERDES1_REFCLK_N: 11. SOC SERDES1 IF (R118.1), 61. SERDES CLOCK GENERATORS (R571.2 R583.1)
SOC_SERDES1_REFCLK_P: 11. SOC SERDES1 IF (R117.1), 61. SERDES CLOCK GENERATORS (R570.2 R582.1)
SOC_WAKE: 19. SOC MCU RGMII & MMC & ADCs (U28.W37), 26. RESET BUTTONs (R544.1 U108.4), 55. SOC PMIC (R532.1)
SOC_WKUP_I2C0_SCL: 17. SOC MCU & MAIN GEN IO, OSC (R509.2 U28.N33), 28. BOARD ID & 40 Pin EXP Hdr (J27.28 U56.6), 44. SGMII EXPANSION HDR (J26.21), 60. SVS MONITOR (U101.3)
SOC_WKUP_I2C0_SDA: 17. SOC MCU & MAIN GEN IO, OSC (R508.2 U28.N35), 28. BOARD ID & 40 Pin EXP Hdr (J27.27 U56.5), 44. SGMII EXPANSION HDR (J26.22), 60. SVS MONITOR (U101.6)
SYS_BOOTMODE0: 16. SOC MCU OSPI0 FLASH (R521.1 U47.4), 27. CPLD (R435.1)
SYS_BOOTMODE1: 16. SOC MCU OSPI0 FLASH (U47.5), 27. CPLD (R432.1)
SYS_BOOTMODE2: 16. SOC MCU OSPI0 FLASH (U47.6), 27. CPLD (R426.1)
SYS_BOOTMODE3: 16. SOC MCU OSPI0 FLASH (U47.7), 27. CPLD (R425.1)
SYS_BOOTMODE4: 17. SOC MCU & MAIN GEN IO, OSC (R402.1), 27. CPLD (U94.4)
SYS_BOOTMODE5: 17. SOC MCU & MAIN GEN IO, OSC (R403.1), 27. CPLD (U94.7)
SYS_BOOTMODE6: 17. SOC MCU & MAIN GEN IO, OSC (R404.1), 27. CPLD (U94.8)
SYS_BOOTMODE7: 17. SOC MCU & MAIN GEN IO, OSC (R410.1), 27. CPLD (U94.9)
SYS_MCU_EN: 26. RESET BUTTONs (TP63.1 U105.4), 55. SOC PMIC (R213.2)
SYS_MCU_PWRDN: 17. SOC MCU & MAIN GEN IO, OSC (R177.2 U28.J38), 26. RESET BUTTONs (R555.1 R560.1 U61.3)
TA_BM_IOEXP_RSTn: 27. CPLD (U88.1), 47. XDS110 DEBUGGER (R473.2), 48. TEST AUTOMATION HEADER (J17.33 R472.1)
TA_BOOTMODE_CNTL#: 47. XDS110 DEBUGGER (R467.2), 48. TEST AUTOMATION HEADER (J17.32 R466.1 TP54.1)
TA_I2C_SCL: 27. CPLD (U88.12), 47. XDS110 DEBUGGER (R478.2), 48. TEST AUTOMATION HEADER (J17.37 R477.2)
TA_I2C_SDA: 27. CPLD (U88.13), 47. XDS110 DEBUGGER (R484.2), 48. TEST AUTOMATION HEADER (J17.39 R482.2)
TA_PORz: 27. CPLD (U91.14), 47. XDS110 DEBUGGER (R444.2), 48. TEST AUTOMATION HEADER (J17.27 R443.1)
TA_POWERDOWNz: 26. RESET BUTTONs (R536.1 U107.2), 47. XDS110 DEBUGGER (R439.2), 48. TEST AUTOMATION HEADER (J17.26)
TA_RESETz: 27. CPLD (U91.13), 47. XDS110 DEBUGGER (R448.2), 48. TEST AUTOMATION HEADER (J17.28 R447.1)
TA_SOC_INT1z: 19. SOC MCU RGMII & MMC & ADCs (Q5.3), 47. XDS110 DEBUGGER (R454.2), 48. TEST AUTOMATION HEADER (J17.30 R453.1)
TA_SOC_INT2z: 19. SOC MCU RGMII & MMC & ADCs (Q4.3), 47. XDS110 DEBUGGER (R460.2), 48. TEST AUTOMATION HEADER (J17.31 R459.1)
TIMER_IO0_R: 18. SOC GENERAL (U28.AR38), 30. MICRO SDCARD INTERFACE (J32.9 R146.2 U84.5)
TIMER_IO1: 18. SOC GENERAL (U28.AN37), 21. SOC USB2.0 (R351.2), 31. USB HUB (R430.1)
UART2_RXD: 18. SOC GENERAL (U28.AM35), 46. QUAD PORT CONSOLE (U71.7)
UART2_TXD: 18. SOC GENERAL (U28.AM36), 46. QUAD PORT CONSOLE (R296.2 U71.9)
UART5_RXD: 18. SOC GENERAL (U28.AJ33), 28. BOARD ID & 40 Pin EXP Hdr (J27.10)
UART5_TXD: 18. SOC GENERAL (U28.AG36), 28. BOARD ID & 40 Pin EXP Hdr (J27.8)
UART8_RXD: 18. SOC GENERAL (U28.AP38), 46. QUAD PORT CONSOLE (U66.6)
UART8_TXD: 18. SOC GENERAL (U28.AN38), 46. QUAD PORT CONSOLE (R300.2 U66.8)
USB0_HUB_D_N: 21. SOC USB2.0 (U28.AP16), 31. USB HUB (U20.54)
USB0_HUB_D_P: 21. SOC USB2.0 (U28.AP17), 31. USB HUB (U20.53)
USB1_DN1_D_N: 31. USB HUB (U20.2), 32. USB 3.0 TYPE A CONN#1 (FL41.1)
USB1_DN1_D_P: 31. USB HUB (U20.1), 32. USB 3.0 TYPE A CONN#1 (FL41.4)
USB1_DN2_D_N: 31. USB HUB (U20.10), 32. USB 3.0 TYPE A CONN#1 (FL35.4)
USB1_DN2_D_P: 31. USB HUB (U20.9), 32. USB 3.0 TYPE A CONN#1 (FL35.1)
USB1_DN3_D_N: 31. USB HUB (U20.18), 33. USB 3.0 TYPE A CONN#2 (L9.1)
USB1_DN3_D_P: 31. USB HUB (U20.17), 33. USB 3.0 TYPE A CONN#2 (L9.4)
USB1_DN4_D_N: 31. USB HUB (U20.25), 34. USB TYPE C 3.0 (FL55.1)
USB1_DN4_D_P: 31. USB HUB (U20.24), 34. USB TYPE C 3.0 (FL55.4)
USB1_SSRX_DN1_N: 31. USB HUB (U20.7), 32. USB 3.0 TYPE A CONN#1 (FL36.4)
USB1_SSRX_DN1_P: 31. USB HUB (U20.6), 32. USB 3.0 TYPE A CONN#1 (FL36.1)
USB1_SSRX_DN2_N: 31. USB HUB (U20.15), 32. USB 3.0 TYPE A CONN#1 (FL21.1)
USB1_SSRX_DN2_P: 31. USB HUB (U20.14), 32. USB 3.0 TYPE A CONN#1 (FL21.4)
USB1_SSRX_DN3_N: 31. USB HUB (U20.23), 33. USB 3.0 TYPE A CONN#2 (L8.4)
USB1_SSRX_DN3_P: 31. USB HUB (U20.22), 33. USB 3.0 TYPE A CONN#2 (L8.1)
USB1_SSRX_DN4_N: 31. USB HUB (U20.30), 34. USB TYPE C 3.0 (U23.8)
USB1_SSRX_DN4_P: 31. USB HUB (U20.29), 34. USB TYPE C 3.0 (U23.7)
USB1_SSTX_DN1_N: 31. USB HUB (C166.2), 32. USB 3.0 TYPE A CONN#1 (FL38.4)
USB1_SSTX_DN1_P: 31. USB HUB (C168.2), 32. USB 3.0 TYPE A CONN#1 (FL38.1)
USB1_SSTX_DN2_N: 31. USB HUB (C155.2), 32. USB 3.0 TYPE A CONN#1 (FL33.1)
USB1_SSTX_DN2_P: 31. USB HUB (C160.2), 32. USB 3.0 TYPE A CONN#1 (FL33.4)
USB1_SSTX_DN3_N: 31. USB HUB (C148.2), 33. USB 3.0 TYPE A CONN#2 (L10.4)
USB1_SSTX_DN3_P: 31. USB HUB (C149.2), 33. USB 3.0 TYPE A CONN#2 (L10.1)
USB1_SSTX_DN4_N: 31. USB HUB (C146.2), 34. USB TYPE C 3.0 (U23.4)
USB1_SSTX_DN4_P: 31. USB HUB (C147.2), 34. USB TYPE C 3.0 (U23.3)
USBC_SS_TX2_N: 10. SOC SERDES0 IF (C164.1), 31. USB HUB (U20.59)
USBC_SS_TX2_P: 10. SOC SERDES0 IF (C163.1), 31. USB HUB (U20.58)
USER_LED1: 17. SOC MCU & MAIN GEN IO, OSC (R187.2 U28.H36), 26. RESET BUTTONs (Q6.3 R550.2)
VCCA_3V3_CORE_IN+: 58. CURRENT MONITORS (C338.2 R295.1 U68.10), 59. CURRENT MONITORS -INA231 (U69.D3)
VCCA_3V3_CORE_IN-: 58. CURRENT MONITORS (C338.1 R297.1 U68.8 U68.9), 59. CURRENT MONITORS -INA231 (U69.D1 U69.D2)
VCCA_3V3_CORE_N: 57. EVM SOC CURRENT_SENSE_RES (R78.5 TP18.1), 58. CURRENT MONITORS (R297.2)
VCCA_3V3_CORE_P: 57. EVM SOC CURRENT_SENSE_RES (R78.2 TP16.1), 58. CURRENT MONITORS (R295.2)
VCCA_3V3_CPU_AVS_IN+: 58. CURRENT MONITORS (C365.2 R339.1 U80.10), 59. CURRENT MONITORS -INA231 (U79.D3)
VCCA_3V3_CPU_AVS_IN-: 58. CURRENT MONITORS (C365.1 R340.1 U80.8 U80.9), 59. CURRENT MONITORS -INA231 (U79.D1 U79.D2)
VCCA_3V3_CPU_AVS_N: 57. EVM SOC CURRENT_SENSE_RES (R53.5 TP26.1), 58. CURRENT MONITORS (R340.2)
VCCA_3V3_CPU_AVS_P: 57. EVM SOC CURRENT_SENSE_RES (R53.2 TP27.1), 58. CURRENT MONITORS (R339.2)
VCCA_3V3_DDR_IN+: 58. CURRENT MONITORS (C729.2 R503.1 U97.10), 59. CURRENT MONITORS -INA231 (U98.D3)
VCCA_3V3_DDR_IN-: 58. CURRENT MONITORS (C729.1 R504.1 U97.8 U97.9), 59. CURRENT MONITORS -INA231 (U98.D1 U98.D2)
VCCA_3V3_DDR_N: 57. EVM SOC CURRENT_SENSE_RES (R522.1 TP66.1), 58. CURRENT MONITORS (R504.2)
VCCA_3V3_DDR_P: 57. EVM SOC CURRENT_SENSE_RES (R522.4 TP65.1), 58. CURRENT MONITORS (R503.2)
VDD_IO_1V8_IN+: 58. CURRENT MONITORS (C786.2 R542.1 U104.10), 59. CURRENT MONITORS -INA231 (U103.D3)
VDD_IO_1V8_IN-: 58. CURRENT MONITORS (C786.1 R545.1 U104.8 U104.9), 59. CURRENT MONITORS -INA231 (U103.D1 U103.D2)
VDD_IO_1V8_N: 57. EVM SOC CURRENT_SENSE_RES (R256.4 TP82.1), 58. CURRENT MONITORS (R545.2)
VDD_IO_1V8_P: 57. EVM SOC CURRENT_SENSE_RES (R256.1 TP81.1), 58. CURRENT MONITORS (R542.2)
VDD_IO_3V3_IN+: 58. CURRENT MONITORS (C560.2 R394.1 U86.10), 59. CURRENT MONITORS -INA231 (U85.D3)
VDD_IO_3V3_IN-: 58. CURRENT MONITORS (C560.1 R390.1 U86.8 U86.9), 59. CURRENT MONITORS -INA231 (U85.D1 U85.D2)
VDD_IO_3V3_N: 57. EVM SOC CURRENT_SENSE_RES (R385.1 TP42.1), 58. CURRENT MONITORS (R390.2)
VDD_IO_3V3_P: 57. EVM SOC CURRENT_SENSE_RES (R385.4 TP43.1), 58. CURRENT MONITORS (R394.2)
VDD_RAM_0V85_N: 57. EVM SOC CURRENT_SENSE_RES (R257.4 TP88.1), 58. CURRENT MONITORS (R547.2)
VDD_RAM_0V85_P: 57. EVM SOC CURRENT_SENSE_RES (R257.1 TP89.1), 58. CURRENT MONITORS (R546.2)
VOUT0_DATA0: 18. SOC GENERAL (U28.AC33), 43. HDMI BRIDGE (U29.63)
VOUT0_DATA1: 18. SOC GENERAL (U28.AH38), 43. HDMI BRIDGE (U29.62)
VOUT0_DATA2: 18. SOC GENERAL (U28.AJ38), 43. HDMI BRIDGE (U29.61)
VOUT0_DATA3: 18. SOC GENERAL (U28.AE38), 43. HDMI BRIDGE (U29.60)
VOUT0_DATA4: 18. SOC GENERAL (U28.AF38), 43. HDMI BRIDGE (U29.59)
VOUT0_DATA5: 18. SOC GENERAL (U28.AE36), 43. HDMI BRIDGE (U29.58)
VOUT0_DATA6: 18. SOC GENERAL (U28.AC36), 43. HDMI BRIDGE (U29.55)
VOUT0_DATA7: 18. SOC GENERAL (U28.AE37), 43. HDMI BRIDGE (U29.54)
VOUT0_DATA8: 18. SOC GENERAL (U28.AD37), 43. HDMI BRIDGE (U29.53)
VOUT0_DATA9: 18. SOC GENERAL (U28.AC37), 43. HDMI BRIDGE (U29.52)
VOUT0_DATA10: 18. SOC GENERAL (U28.AC32), 43. HDMI BRIDGE (U29.51)
VOUT0_DATA11: 18. SOC GENERAL (U28.AK33), 43. HDMI BRIDGE (U29.50)
VOUT0_DATA12: 18. SOC GENERAL (U28.AG37), 43. HDMI BRIDGE (U29.47)
VOUT0_DATA13: 18. SOC GENERAL (U28.AF37), 43. HDMI BRIDGE (U29.46)
VOUT0_DATA14: 18. SOC GENERAL (U28.AK38), 43. HDMI BRIDGE (U29.45)
VOUT0_DATA15: 18. SOC GENERAL (U28.AK35), 43. HDMI BRIDGE (U29.44)
VOUT0_DATA16: 18. SOC GENERAL (U28.AJ32), 43. HDMI BRIDGE (U29.43)
VOUT0_DATA17: 18. SOC GENERAL (U28.AK37), 43. HDMI BRIDGE (U29.42)
VOUT0_DATA18: 18. SOC GENERAL (U28.AL32), 43. HDMI BRIDGE (U29.41)
VOUT0_DATA19: 18. SOC GENERAL (U28.AE33), 43. HDMI BRIDGE (U29.40)
VOUT0_DATA20: 18. SOC GENERAL (U28.AH34), 43. HDMI BRIDGE (U29.39)
VOUT0_DATA21: 18. SOC GENERAL (U28.AJ35), 43. HDMI BRIDGE (U29.38)
VOUT0_DATA22: 18. SOC GENERAL (U28.AG34), 43. HDMI BRIDGE (U29.37)
VOUT0_DATA23: 18. SOC GENERAL (U28.AK36), 43. HDMI BRIDGE (U29.36)
VOUT0_DE: 18. SOC GENERAL (U28.AG38), 43. HDMI BRIDGE (TP98.1 U29.2)
VOUT0_HSYNC: 18. SOC GENERAL (U28.AK34), 43. HDMI BRIDGE (TP97.1 U29.4)
VOUT0_PCLK: 18. SOC GENERAL (R142.2), 43. HDMI BRIDGE (TP96.1 U29.57)
VOUT0_VSYNC: 18. SOC GENERAL (U28.AF36), 43. HDMI BRIDGE (TP99.1 U29.5)
WKUP_GPIO0_49: 17. SOC MCU & MAIN GEN IO, OSC (U28.M33), 28. BOARD ID & 40 Pin EXP Hdr (J27.15)
WKUP_GPIO0_54: 17. SOC MCU & MAIN GEN IO, OSC (R190.2 U28.G38), 27. CPLD (U99.1)
WKUP_GPIO0_56: 17. SOC MCU & MAIN GEN IO, OSC (R402.2 U28.M37), 28. BOARD ID & 40 Pin EXP Hdr (U53.2)
WKUP_GPIO0_57: 17. SOC MCU & MAIN GEN IO, OSC (R403.2 U28.M36), 28. BOARD ID & 40 Pin EXP Hdr (U53.3)
WKUP_GPIO0_66: 17. SOC MCU & MAIN GEN IO, OSC (R161.1 R404.2 U28.N34), 28. BOARD ID & 40 Pin EXP Hdr (U53.4)
WKUP_GPIO0_67: 17. SOC MCU & MAIN GEN IO, OSC (R410.2 U28.M34), 28. BOARD ID & 40 Pin EXP Hdr (U53.5)
WKUP_GPIO0_70: 17. SOC MCU & MAIN GEN IO, OSC (U28.F37), 41. FPC Camera (U62.10)
WKUP_GPIO0_88: 17. SOC MCU & MAIN GEN IO, OSC (U28.L38), 41. FPC Camera (U62.12)
WKUP_UART0_CTSn: 17. SOC MCU & MAIN GEN IO, OSC (U28.L37), 46. QUAD PORT CONSOLE (U70.7)
WKUP_UART0_RTSn: 17. SOC MCU & MAIN GEN IO, OSC (U28.L36), 46. QUAD PORT CONSOLE (R294.2 U70.9)
WKUP_UART0_RXD: 17. SOC MCU & MAIN GEN IO, OSC (U28.K35), 46. QUAD PORT CONSOLE (U71.6)
WKUP_UART0_TXD: 17. SOC MCU & MAIN GEN IO, OSC (U28.K34), 46. QUAD PORT CONSOLE (R298.2 U71.8)
XDS110_EMU0: 20. SOC DEBUG (U89.10), 47. XDS110 DEBUGGER (R406.1 U82.42)
XDS110_EMU1: 20. SOC DEBUG (U89.13), 47. XDS110 DEBUGGER (R418.1 U82.43)
XDS110_TCK: 20. SOC DEBUG (U89.3), 47. XDS110 DEBUGGER (U82.35)
XDS110_TDI: 20. SOC DEBUG (U37.6), 47. XDS110 DEBUGGER (U82.38)
XDS110_TDO: 20. SOC DEBUG (U37.3), 47. XDS110 DEBUGGER (U82.37)
XDS110_TMS: 20. SOC DEBUG (U37.10), 47. XDS110 DEBUGGER (U82.36)
XDS110_TRST#: 20. SOC DEBUG (U89.6), 47. XDS110 DEBUGGER (U82.40)